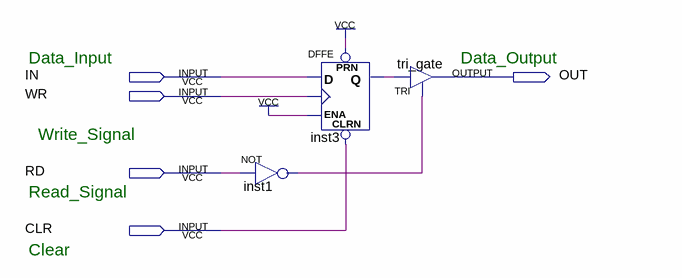
[diagram p0: schematic sheet]
// Quartus schematic Memory_Unit_1Bit_dffe.bdf as structural Verilog: 3 symbols, 5 pins
module Memory_Unit_1Bit_dffe (
  input  IN,
  input  WR,
  input  RD,
  input  CLR,
  output OUT
);

  wire inst1_out, inst3_q;

  not inst1 (inst1_out, RD);
  DFFE inst3 (.PRN(1'b1), .CLRN(CLR), .D(IN), .CLK(WR), .ENA(1'b1), .Q(inst3_q));
  TRI tri_gate (.IN(inst3_q), .OE(inst1_out), .OUT(OUT));

  // Notes on the sheet:
  //   Data_Input
  //   Data_Output
  //   Write_Signal
  //   Read_Signal
  //   Clear
endmodule
